# EAGLE design LED Heart Shield Strips (EAGLE 7.3.0)
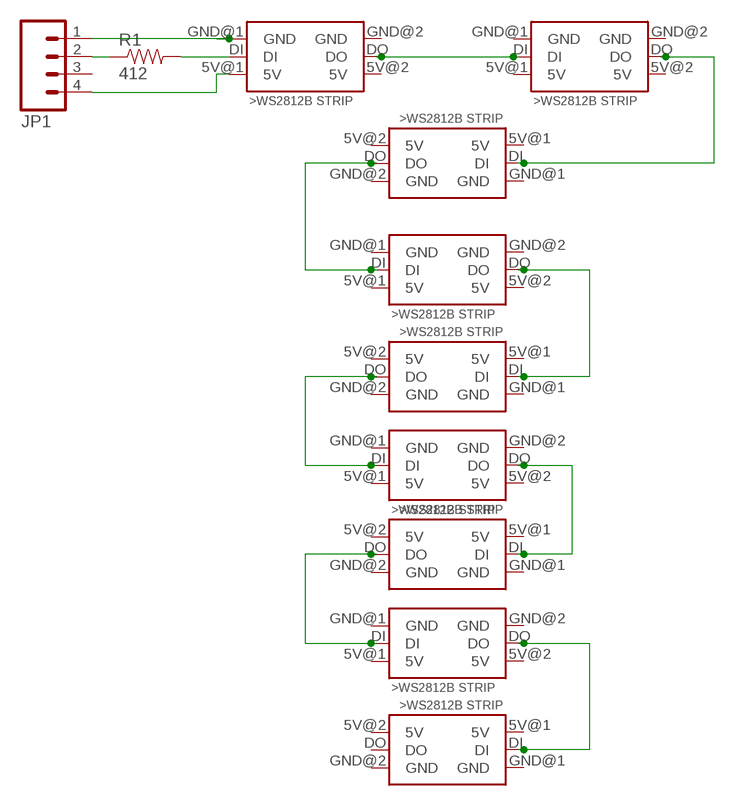
[diagram p0: schematic, sheet 1]

## Parts
IC1  WS2812BSTRIP602  [WS2812BSTRIP60_2]
IC2  WS2812BSTRIP602  [WS2812BSTRIP60_2]
IC3  WS2812BSTRIP606  [WS2812BSTRIP60_6]
IC4  WS2812BSTRIP606  [WS2812BSTRIP60_6]
IC5  WS2812BSTRIP605  [WS2812BSTRIP60_5]
IC6  WS2812BSTRIP604  [WS2812BSTRIP60_4]
IC7  WS2812BSTRIP603  [WS2812BSTRIP60_3]
IC8  WS2812BSTRIP602  [WS2812BSTRIP60_2]
IC9  WS2812BSTRIP601  [WS2812BSTRIP60_1]
JP1  M04NO_SILK_ALL_ROUND  [1X04_NO_SILK_ALL_ROUND]
R1  412  RESISTOR1206  [1206]

## Nets
N$1: IC1.GND@1(GND) JP1.1
N$2: IC1.DO IC2.DI
N$3: IC2.DO IC3.DI
N$4: IC1.5V@1(5V) JP1.4
N$5: IC1.DI R1.2
N$6: IC3.DO IC4.DI
N$7: IC4.DO IC5.DI
N$8: IC5.DO IC6.DI
N$9: IC6.DO IC7.DI
N$10: IC7.DO IC8.DI
N$11: IC8.DO IC9.DI
N$12: JP1.2 R1.1
Unconnected: IC9.DO JP1.3

## Power pins joined to a net without a drawn wire
5V: IC1.5V@2(5V) IC2.5V@1(5V) IC2.5V@2(5V) IC3.5V@1(5V) IC3.5V@2(5V) IC4.5V@1(5V) IC4.5V@2(5V) IC5.5V@1(5V) IC5.5V@2(5V) IC6.5V@1(5V) IC6.5V@2(5V) IC7.5V@1(5V) IC7.5V@2(5V) IC8.5V@1(5V) IC8.5V@2(5V) IC9.5V@1(5V) IC9.5V@2(5V)
GND: IC1.GND@2(GND) IC2.GND@1(GND) IC2.GND@2(GND) IC3.GND@1(GND) IC3.GND@2(GND) IC4.GND@1(GND) IC4.GND@2(GND) IC5.GND@1(GND) IC5.GND@2(GND) IC6.GND@1(GND) IC6.GND@2(GND) IC7.GND@1(GND) IC7.GND@2(GND) IC8.GND@1(GND) IC8.GND@2(GND) IC9.GND@1(GND) IC9.GND@2(GND)

## Library data of the parts
IC1-IC9 = eagle-library:WS2812BSTRIP60
JP1 = SparkFun-Connectors:M04: Header 4 Standard 4-pin 0.1" header. Use with straight break away headers (SKU : PRT-00116), right angle break away headers (PRT-00553), swiss pins (PRT-00743), machine pins (PRT-00117), and female headers (PRT-00115). Molex polarized connector foot print use with SKU : PRT-08231 with associated crimp pins and housings. 1MM SMD Version SKU: PRT-10208
R1 = SparkFun-Passives:RESISTOR: Resistor Basic schematic elements and footprints for 0603, 1206, and PTH resistors.

## Board
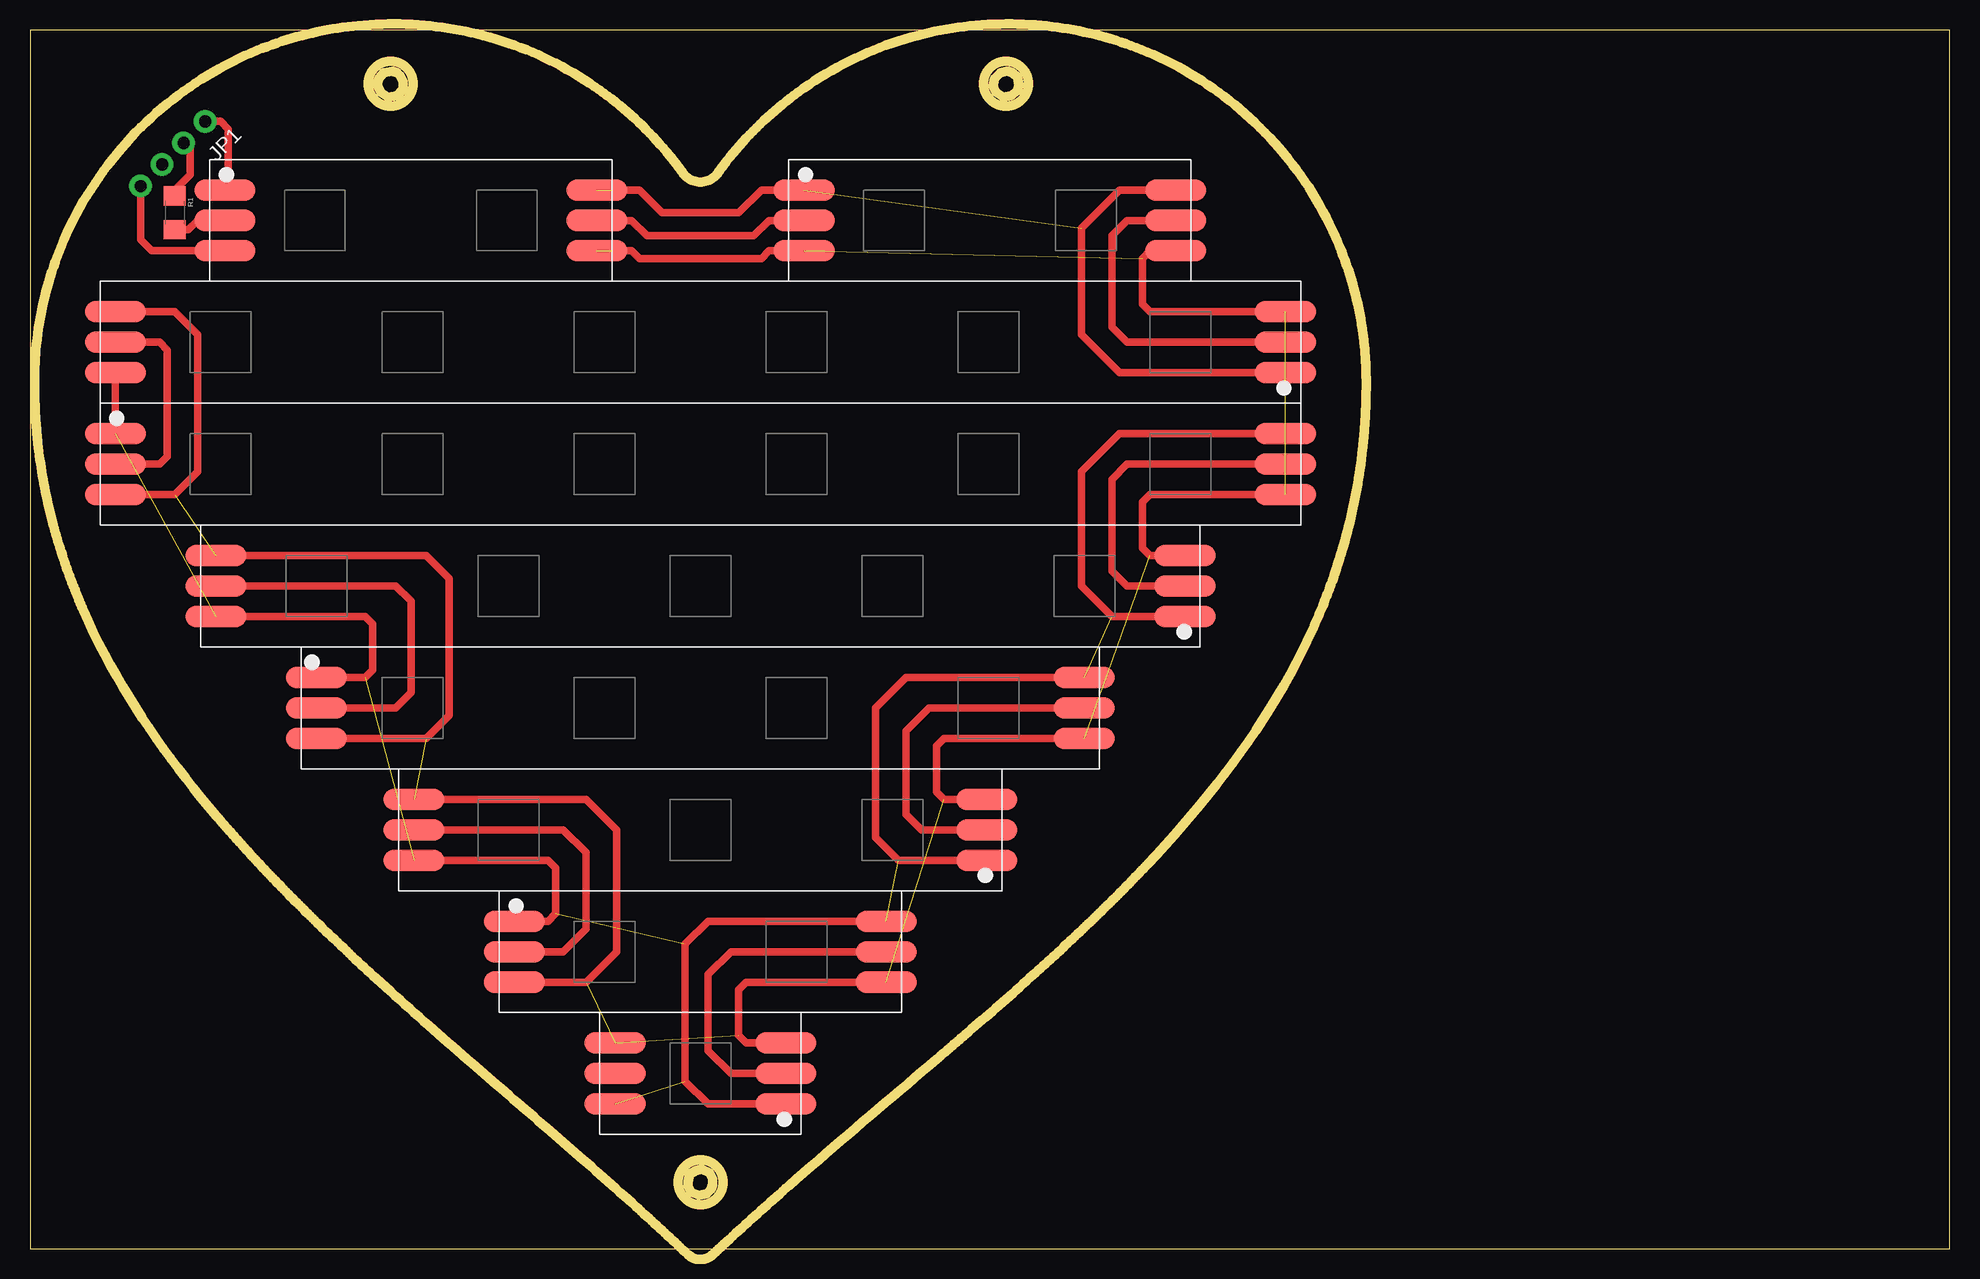
[diagram p1: board, top side]

Size 160 x 101.6 mm. Coordinates in mm from the lower left corner, seen from the top.
Outline: 0,0 160,0 160,101.6 0,101.6 0,0
Copper layers (1*16): Top 0.035mm / dielectric 1.5mm / Bottom 0.035mm
Design rules "default": minimum track width 10mil, minimum drill 24mil, track to track 8mil, track to pad 8mil, pad to pad 8mil, via to via 8mil, smd to smd 8mil, copper to edge 40mil, drill to drill 8mil, minimum pad ring 10mil, minimum via ring 8mil, stop-mask expansion 4mil, vias tented up to drill 0mil, thermal gap 10mil
Milling: area 28.2,95.2 to 31.9,99; area 79.5,95.2 to 83.2,99; area 54,3.7 to 57.7,7.4; 1082 lines

### Footprints (pad centres in the part's own frame; a part is rotated, then mirrored left to right if it is on the bottom)
WS2812BSTRIP60_2 = smd 5.08 x 1.778: 5V@1 -15.494,-2.54; 5V@2 15.494,-2.54; DI -15.494,0; DO 15.494,0; GND@1 -15.494,2.54; GND@2 15.494,2.54
WS2812BSTRIP60_6 = smd 5.08 x 1.778: 5V@1 -48.768,-2.54; 5V@2 48.768,-2.54; DI -48.768,0; DO 48.768,0; GND@1 -48.768,2.54; GND@2 48.768,2.54
WS2812BSTRIP60_5 = smd 5.08 x 1.778: 5V@1 -40.386,-2.54; 5V@2 40.386,-2.54; DI -40.386,0; DO 40.386,0; GND@1 -40.386,2.54; GND@2 40.386,2.54
WS2812BSTRIP60_4 = smd 5.08 x 1.778: 5V@1 -32.004,-2.54; 5V@2 32.004,-2.54; DI -32.004,0; DO 32.004,0; GND@1 -32.004,2.54; GND@2 32.004,2.54
WS2812BSTRIP60_3 = smd 5.08 x 1.778: 5V@1 -23.876,-2.54; 5V@2 23.876,-2.54; DI -23.876,0; DO 23.876,0; GND@1 -23.876,2.54; GND@2 23.876,2.54
WS2812BSTRIP60_1 = smd 5.08 x 1.778: 5V@1 -7.112,-2.54; 5V@2 7.112,-2.54; DI -7.112,0; DO 7.112,0; GND@1 -7.112,2.54; GND@2 7.112,2.54
1X04_NO_SILK_ALL_ROUND = drill 1.016 pad 1.88: 1 0,0; 2 2.54,0; 3 5.08,0; 4 7.62,0
1206 = smd 1.6 x 1.8: 1 -1.4,0; 2 1.4,0

### Placement (x,y rotation side)
IC1  31.75,85.72 0 top
IC2  80.01,85.72 0 top
IC3  55.88,75.56 180 top
IC4  55.88,65.41 0 top
IC5  55.88,55.24 180 top
IC6  55.88,45.09 0 top
IC7  55.88,34.92 180 top
IC8  55.88,24.77 0 top
IC9  55.88,14.61 180 top
JP1  14.61,93.98 225 top
R1  12.06,86.36 270 top

### Tracks (layer width: path | path; a pad name or v marks a point on that pad's centre or on a via)
5V  (9 unrouted)
  Top 0.61: 81.28,37.72 IC7.5V@1 76.2,37.47 75.56,38.1 75.56,41.91 76.2,42.55 IC6.5V@2 | 48.51,83.19 50.16,83.19 50.8,82.55 60.96,82.55 61.59,83.19 IC2.5V@1 | IC3.5V@2 12.06,78.11 13.97,76.2 13.97,64.77 12.06,62.87 IC4.5V@1 | IC2.5V@2 93.34,83.19 92.71,82.55 92.71,78.74 93.34,78.11 IC3.5V@1 | IC5.5V@1 93.34,57.78 92.71,58.42 92.71,62.23 93.34,62.87 IC4.5V@2 | IC5.5V@2 33.02,57.78 34.92,55.88 34.92,44.45 33.02,42.55 IC6.5V@1 | IC8.5V@1 46.35,22.23 48.9,24.77 48.9,34.92 46.35,37.47 IC7.5V@2 | IC9.5V@1 59.69,17.14 59.05,17.78 59.05,21.59 59.69,22.23 IC8.5V@2
GND  (9 unrouted)
  Top 0.61: 38.73,27.69 IC8.GND@1 43.18,27.3 43.81,27.94 43.81,31.75 43.18,32.38 IC7.GND@2 | 48.51,88.27 50.8,88.27 52.7,86.36 59.05,86.36 60.96,88.27 IC2.GND@1 | IC3.GND@2 IC4.GND@1 | IC2.GND@2 90.81,88.27 87.63,85.09 87.63,76.2 90.81,73.03 IC3.GND@1 | IC5.GND@1 90.17,52.7 87.63,55.24 87.63,64.77 90.81,67.94 IC4.GND@2 | IC5.GND@2 27.94,52.7 28.57,52.07 28.57,48.26 27.94,47.62 IC6.GND@1 | IC7.GND@1 72.39,32.38 70.48,34.29 70.48,45.09 73.03,47.62 IC6.GND@2 | IC9.GND@1 56.52,12.06 54.61,13.97 54.61,25.4 56.52,27.3 IC8.GND@2
N$1
  Top 0.61: JP1.1 15.88,93.98 16.51,93.34 16.51,88.52 IC1.GND@1
N$2
  Top 0.61: IC1.DO 50.16,85.72 51.44,84.45 60.33,84.45 61.59,85.72 IC2.DI
N$3
  Top 0.61: IC2.DO 91.44,85.72 90.17,84.45 90.17,76.83 91.44,75.56 IC3.DI
N$4
  Top 0.61: JP1.4 9.22,84.13 10.16,83.19 IC1.5V@1
N$5
  Top 0.61: R1.2 13.21,84.96 13.97,85.72 IC1.DI
N$6
  Top 0.61: IC3.DO 10.79,75.56 11.43,74.93 11.43,66.04 10.79,65.41 IC4.DI
N$7
  Top 0.61: IC5.DI 91.44,55.24 90.17,56.52 90.17,64.14 91.44,65.41 IC4.DO
N$8
  Top 0.61: IC5.DO 30.48,55.24 31.75,53.98 31.75,46.35 30.48,45.09 IC6.DI
N$9
  Top 0.61: IC7.DI 74.3,34.92 73.03,36.2 73.03,43.18 74.93,45.09 IC6.DO
N$10
  Top 0.61: IC8.DI 44.45,24.77 46.35,26.67 46.35,33.02 44.45,34.92 IC7.DO
N$11
  Top 0.61: IC9.DI 58.42,14.61 56.52,16.51 56.52,22.86 58.42,24.77 IC8.DO
N$12
  Top 0.61: JP1.2 13.34,92.18 13.34,89.53 12.06,88.27 R1.1